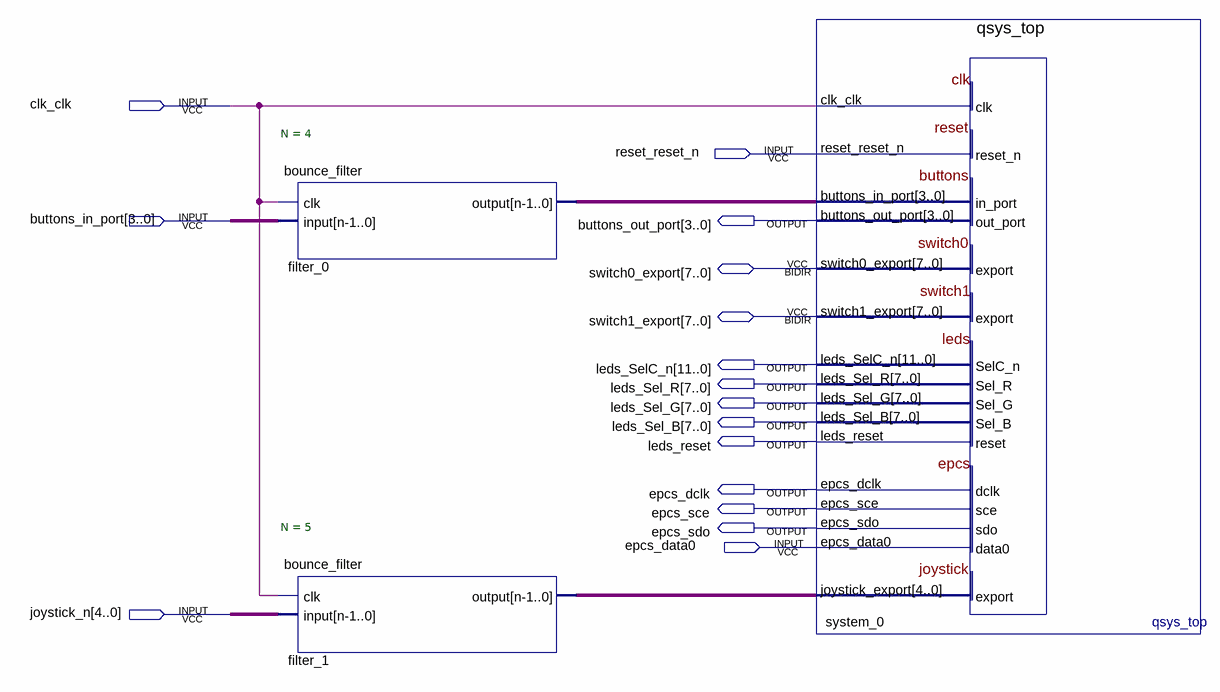
[diagram p0: schematic sheet]
// Quartus schematic config.bdf as structural Verilog: 3 symbols, 16 pins
module \config  (
  input  clk_clk,
  input  reset_reset_n,
  input  [3:0] buttons_in_port,
  input  epcs_data0,
  input  [4:0] joystick_n,
  inout  [7:0] switch0_export,
  inout  [7:0] switch1_export,
  output [3:0] buttons_out_port,
  output [11:0] leds_SelC_n,
  output [7:0] leds_Sel_R,
  output [7:0] leds_Sel_G,
  output [7:0] leds_Sel_B,
  output leds_reset,
  output epcs_dclk,
  output epcs_sce,
  output epcs_sdo
);

  wire [3:0] filter_0_output;
  wire [4:0] filter_1_output;

  bounce_filter #(.N(4)) filter_0 (.clk(clk_clk), .\input (buttons_in_port), .\output (filter_0_output));
  bounce_filter #(.N(5)) filter_1 (.clk(clk_clk), .\input (joystick_n), .\output (filter_1_output));
  qsys_top system_0 (
    .clk_clk(clk_clk), .reset_reset_n(reset_reset_n), .buttons_in_port(filter_0_output),
    .joystick_export(filter_1_output), .buttons_out_port(buttons_out_port), .leds_SelC_n(leds_SelC_n),
    .leds_Sel_R(leds_Sel_R), .leds_Sel_G(leds_Sel_G), .leds_Sel_B(leds_Sel_B), .leds_reset(leds_reset),
    .epcs_dclk(epcs_dclk), .epcs_sce(epcs_sce), .epcs_sdo(epcs_sdo), .switch0_export(switch0_export),
    .switch1_export(switch1_export));  // open: epcs_data0
endmodule
